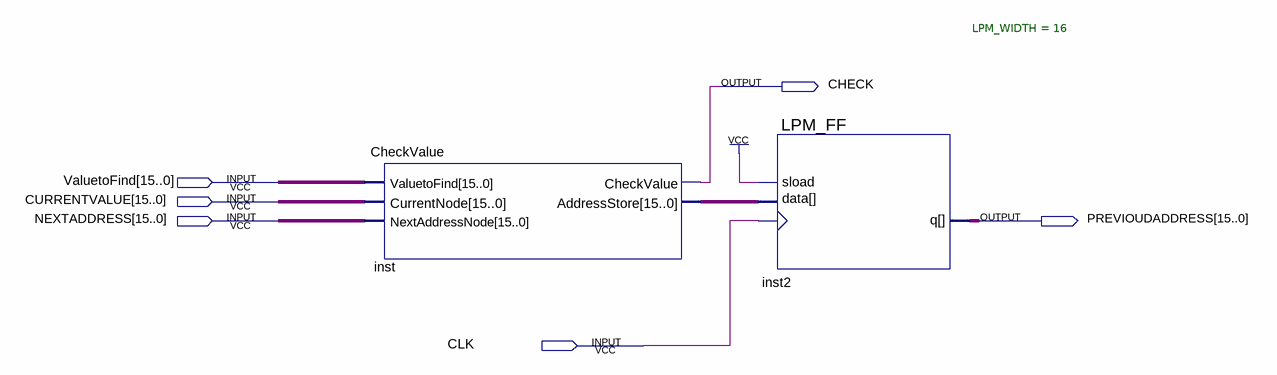
[diagram p0: schematic sheet]
// Quartus schematic Check.bdf as structural Verilog: 2 symbols, 6 pins
module Check (
  input  [15:0] ValuetoFind,
  input  [15:0] CURRENTVALUE,
  input  [15:0] NEXTADDRESS,
  input  CLK,
  output CHECK,
  output [15:0] PREVIOUDADDRESS
);

  wire [15:0] inst_addressstore;

  CheckValue inst (
    .ValuetoFind(ValuetoFind), .CurrentNode(CURRENTVALUE), .NextAddressNode(NEXTADDRESS), .CheckValue(CHECK),
    .AddressStore(inst_addressstore));
  LPM_FF #(.LPM_WIDTH(16)) inst2 (.clock(CLK), .data(inst_addressstore), .sload(1'b1), .q(PREVIOUDADDRESS));
endmodule
